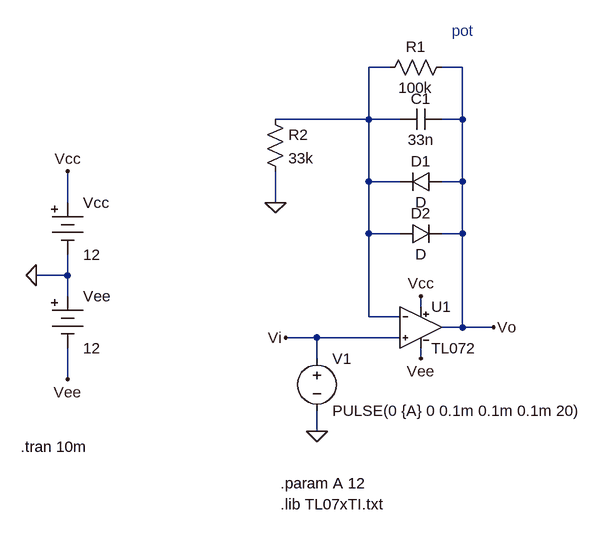
[diagram p0: schematic distorsion_stage.asc]
distorsion_stage.asc, the LTspice schematic file:
Version 4
SHEET 1 880 680
WIRE 192 -256 160 -256
WIRE 304 -256 272 -256
WIRE 160 -176 160 -256
WIRE 160 -176 16 -176
WIRE 208 -176 160 -176
WIRE 304 -176 304 -256
WIRE 304 -176 272 -176
WIRE 160 -80 160 -176
WIRE 208 -80 160 -80
WIRE 304 -80 304 -176
WIRE 304 -80 272 -80
WIRE -304 -48 -304 -96
WIRE 16 -48 16 -96
WIRE 160 0 160 -80
WIRE 208 0 160 0
WIRE 304 0 304 -80
WIRE 304 0 272 0
WIRE -304 64 -304 32
WIRE -304 64 -352 64
WIRE -304 96 -304 64
WIRE 240 112 240 96
WIRE 160 128 160 0
WIRE 208 128 160 128
WIRE 304 144 304 0
WIRE 304 144 272 144
WIRE 352 144 304 144
WIRE 80 160 32 160
WIRE 208 160 80 160
WIRE 80 192 80 160
WIRE 240 192 240 176
WIRE -304 224 -304 176
WIRE 80 304 80 272
FLAG 16 -48 0
FLAG 352 144 Vo
FLAG 32 160 Vi
FLAG 80 304 0
FLAG -304 224 Vee
FLAG -304 -96 Vcc
FLAG -352 64 0
FLAG 240 96 Vcc
FLAG 240 192 Vee
SYMBOL diode 272 -96 R90
WINDOW 0 0 32 VBottom 2
WINDOW 3 32 32 VTop 2
SYMATTR InstName D1
SYMBOL diode 208 16 R270
WINDOW 0 32 32 VTop 2
WINDOW 3 0 32 VBottom 2
SYMATTR InstName D2
SYMBOL res 288 -272 R90
WINDOW 0 0 56 VBottom 2
WINDOW 3 32 56 VTop 2
SYMATTR InstName R1
SYMATTR Value 100k
SYMBOL res 0 -192 R0
SYMATTR InstName R2
SYMATTR Value 33k
SYMBOL cap 272 -192 R90
WINDOW 0 0 32 VBottom 2
WINDOW 3 32 32 VTop 2
SYMATTR InstName C1
SYMATTR Value 33n
SYMBOL voltage 80 176 R0
WINDOW 123 0 0 Left 0
WINDOW 39 0 0 Left 0
SYMATTR InstName V1
SYMATTR Value PULSE(0 {A} 0 0.1m 0.1m 0.1m 20)
SYMBOL Misc\\battery -304 -64 R0
SYMATTR InstName Vcc
SYMATTR Value 12
SYMBOL Misc\\battery -304 80 R0
SYMATTR InstName Vee
SYMATTR Value 12
SYMBOL TL072 240 80 R0
SYMATTR InstName U1
TEXT 288 -312 Left 2 ;pot
TEXT -376 328 Left 2 !.tran 10m
TEXT 24 384 Left 2 !.param A 12
TEXT 24 416 Left 2 !.lib TL07xTI.txt

The netlist it stands for:
* distorsion_stage.asc
D1 Vo N001 D
D2 N001 Vo D
R1 Vo N001 100k
R2 N001 0 33k
C1 Vo N001 33n
V1 Vi 0 PULSE(0 {A} 0 0.1m 0.1m 0.1m 20)
Vcc Vcc 0 12
Vee 0 Vee 12
XU1 Vi N001 Vo Vcc Vee TL072  ; pins In+ In- OUT V+ V-
.model D D
.lib standard.dio
* pot
.tran 10m
.param A 12
.lib TL07xTI.txt
.backanno
.end